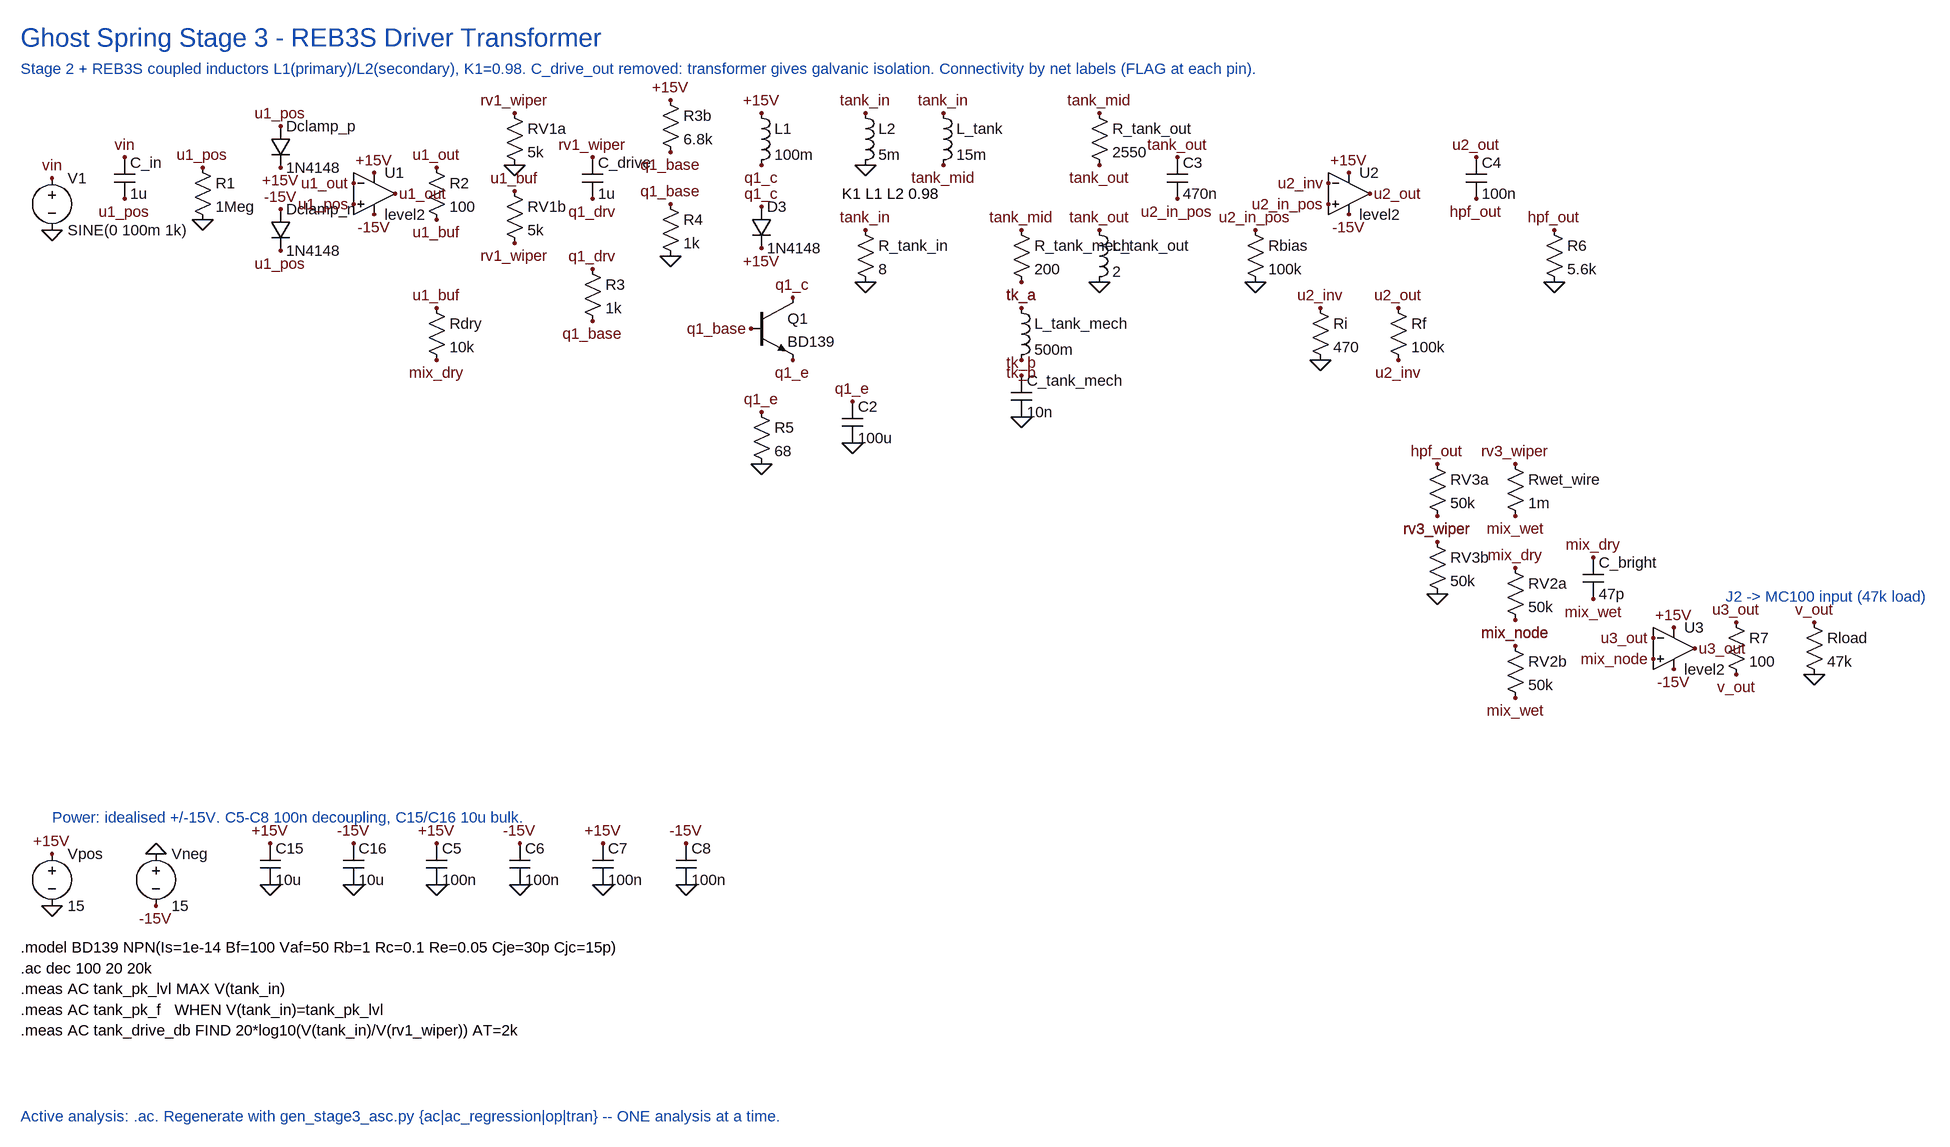
[diagram p0: schematic stage_03_transformer.asc]
stage_03_transformer.asc, the LTspice schematic file:
Version 4
SHEET 1 2400 1600
TEXT 16 -40 Left 4 Ghost Spring Stage 3 - REB3S Driver Transformer
TEXT 16 8 Left 2 Stage 2 + REB3S coupled inductors L1(primary)/L2(secondary), K1=0.98. C_drive_out removed: transformer gives galvanic isolation. Connectivity by net labels (FLAG at each pin).
SYMBOL voltage 64 1200 R0
SYMATTR InstName Vpos
SYMATTR Value 15
FLAG 64 1216 +15V
FLAG 64 1296 0
SYMBOL voltage 224 1200 R0
SYMATTR InstName Vneg
SYMATTR Value 15
FLAG 224 1216 0
FLAG 224 1296 -15V
SYMBOL cap 384 1200 R0
SYMATTR InstName C15
SYMATTR Value 10u
FLAG 400 1200 +15V
FLAG 400 1264 0
SYMBOL cap 512 1200 R0
SYMATTR InstName C16
SYMATTR Value 10u
FLAG 528 1200 -15V
FLAG 528 1264 0
SYMBOL cap 640 1200 R0
SYMATTR InstName C5
SYMATTR Value 100n
FLAG 656 1200 +15V
FLAG 656 1264 0
SYMBOL cap 768 1200 R0
SYMATTR InstName C6
SYMATTR Value 100n
FLAG 784 1200 -15V
FLAG 784 1264 0
SYMBOL cap 896 1200 R0
SYMATTR InstName C7
SYMATTR Value 100n
FLAG 912 1200 +15V
FLAG 912 1264 0
SYMBOL cap 1024 1200 R0
SYMATTR InstName C8
SYMATTR Value 100n
FLAG 1040 1200 -15V
FLAG 1040 1264 0
TEXT 64 1160 Left 2 Power: idealised +/-15V. C5-C8 100n decoupling, C15/C16 10u bulk.
SYMBOL voltage 64 160 R0
SYMATTR InstName V1
SYMATTR Value SINE(0 100m 1k)
SYMATTR Value2 AC 1
FLAG 64 176 vin
FLAG 64 256 0
SYMBOL cap 160 144 R0
SYMATTR InstName C_in
SYMATTR Value 1u
FLAG 176 144 vin
FLAG 176 208 u1_pos
SYMBOL res 280 144 R0
SYMATTR InstName R1
SYMATTR Value 1Meg
FLAG 296 160 u1_pos
FLAG 296 240 0
SYMBOL diode 400 96 R0
SYMATTR InstName Dclamp_p
SYMATTR Value 1N4148
FLAG 416 96 u1_pos
FLAG 416 160 +15V
SYMBOL diode 400 224 R0
SYMATTR InstName Dclamp_n
SYMATTR Value 1N4148
FLAG 416 224 -15V
FLAG 416 288 u1_pos
SYMBOL UniversalOpamp2 560 200 R0
SYMATTR InstName U1
SYMATTR Value level2
SYMATTR Value2 Avol=1Meg GBW=8Meg Slew=20Meg Ilimit=25m Rail=0 Rinc=1T
FLAG 528 216 u1_pos
FLAG 528 184 u1_out
FLAG 560 168 +15V
FLAG 560 232 -15V
FLAG 592 200 u1_out
SYMBOL res 640 144 R0
SYMATTR InstName R2
SYMATTR Value 100
FLAG 656 160 u1_out
FLAG 656 240 u1_buf
SYMBOL res 760 60 R0
SYMATTR InstName RV1a
SYMATTR Value 5k
FLAG 776 76 rv1_wiper
FLAG 776 156 0
SYMBOL res 760 180 R0
SYMATTR InstName RV1b
SYMATTR Value 5k
FLAG 776 196 u1_buf
FLAG 776 276 rv1_wiper
SYMBOL cap 880 144 R0
SYMATTR InstName C_drive
SYMATTR Value 1u
FLAG 896 144 rv1_wiper
FLAG 896 208 q1_drv
SYMBOL res 1000 40 R0
SYMATTR InstName R3b
SYMATTR Value 6.8k
FLAG 1016 56 +15V
FLAG 1016 136 q1_base
SYMBOL res 1000 200 R0
SYMATTR InstName R4
SYMATTR Value 1k
FLAG 1016 216 q1_base
FLAG 1016 296 0
SYMBOL res 880 300 R0
SYMATTR InstName R3
SYMATTR Value 1k
FLAG 896 316 q1_drv
FLAG 896 396 q1_base
SYMBOL npn 1140 360 R0
SYMATTR InstName Q1
SYMATTR Value BD139
FLAG 1140 408 q1_base
FLAG 1204 360 q1_c
FLAG 1204 456 q1_e
SYMBOL res 1140 520 R0
SYMATTR InstName R5
SYMATTR Value 68
FLAG 1156 536 q1_e
FLAG 1156 616 0
SYMBOL cap 1280 520 R0
SYMATTR InstName C2
SYMATTR Value 100u
FLAG 1296 520 q1_e
FLAG 1296 584 0
SYMBOL diode 1140 220 R0
SYMATTR InstName D3
SYMATTR Value 1N4148
FLAG 1156 220 q1_c
FLAG 1156 284 +15V
SYMBOL ind 1140 60 R0
SYMATTR InstName L1
SYMATTR Value 100m
SYMATTR SpiceLine Rser=0
FLAG 1156 76 +15V
FLAG 1156 156 q1_c
SYMBOL ind 1300 60 R0
SYMATTR InstName L2
SYMATTR Value 5m
SYMATTR SpiceLine Rser=0
FLAG 1316 76 tank_in
FLAG 1316 156 0
TEXT 1280 200 Left 2 !K1 L1 L2 0.98
SYMBOL res 1300 240 R0
SYMATTR InstName R_tank_in
SYMATTR Value 8
FLAG 1316 256 tank_in
FLAG 1316 336 0
SYMBOL ind 1420 60 R0
SYMATTR InstName L_tank
SYMATTR Value 15m
SYMATTR SpiceLine Rser=0
FLAG 1436 76 tank_in
FLAG 1436 156 tank_mid
SYMBOL res 1540 240 R0
SYMATTR InstName R_tank_mech
SYMATTR Value 200
FLAG 1556 256 tank_mid
FLAG 1556 336 tk_a
SYMBOL ind 1540 360 R0
SYMATTR InstName L_tank_mech
SYMATTR Value 500m
SYMATTR SpiceLine Rser=0
FLAG 1556 376 tk_a
FLAG 1556 456 tk_b
SYMBOL cap 1540 480 R0
SYMATTR InstName C_tank_mech
SYMATTR Value 10n
FLAG 1556 480 tk_b
FLAG 1556 544 0
SYMBOL res 1660 60 R0
SYMATTR InstName R_tank_out
SYMATTR Value 2550
FLAG 1676 76 tank_mid
FLAG 1676 156 tank_out
SYMBOL ind 1660 240 R0
SYMATTR InstName L_tank_out
SYMATTR Value 2
SYMATTR SpiceLine Rser=0
FLAG 1676 256 tank_out
FLAG 1676 336 0
SYMBOL cap 1780 144 R0
SYMATTR InstName C3
SYMATTR Value 470n
FLAG 1796 144 tank_out
FLAG 1796 208 u2_in_pos
SYMBOL res 1900 240 R0
SYMATTR InstName Rbias
SYMATTR Value 100k
FLAG 1916 256 u2_in_pos
FLAG 1916 336 0
SYMBOL UniversalOpamp2 2060 200 R0
SYMATTR InstName U2
SYMATTR Value level2
SYMATTR Value2 Avol=1Meg GBW=8Meg Slew=20Meg Ilimit=25m Rail=0 Rinc=1T
FLAG 2028 216 u2_in_pos
FLAG 2028 184 u2_inv
FLAG 2060 168 +15V
FLAG 2060 232 -15V
FLAG 2092 200 u2_out
SYMBOL res 2000 360 R0
SYMATTR InstName Ri
SYMATTR Value 470
FLAG 2016 376 u2_inv
FLAG 2016 456 0
SYMBOL res 2120 360 R0
SYMATTR InstName Rf
SYMATTR Value 100k
FLAG 2136 376 u2_out
FLAG 2136 456 u2_inv
SYMBOL cap 2240 144 R0
SYMATTR InstName C4
SYMATTR Value 100n
FLAG 2256 144 u2_out
FLAG 2256 208 hpf_out
SYMBOL res 2360 240 R0
SYMATTR InstName R6
SYMATTR Value 5.6k
FLAG 2376 256 hpf_out
FLAG 2376 336 0
SYMBOL res 2180 600 R0
SYMATTR InstName RV3a
SYMATTR Value 50k
FLAG 2196 616 hpf_out
FLAG 2196 696 rv3_wiper
SYMBOL res 2180 720 R0
SYMATTR InstName RV3b
SYMATTR Value 50k
FLAG 2196 736 rv3_wiper
FLAG 2196 816 0
SYMBOL res 640 360 R0
SYMATTR InstName Rdry
SYMATTR Value 10k
FLAG 656 376 u1_buf
FLAG 656 456 mix_dry
SYMBOL res 2300 760 R0
SYMATTR InstName RV2a
SYMATTR Value 50k
FLAG 2316 776 mix_dry
FLAG 2316 856 mix_node
SYMBOL res 2300 880 R0
SYMATTR InstName RV2b
SYMATTR Value 50k
FLAG 2316 896 mix_node
FLAG 2316 976 mix_wet
SYMBOL cap 2420 760 R0
SYMATTR InstName C_bright
SYMATTR Value 47p
FLAG 2436 760 mix_dry
FLAG 2436 824 mix_wet
SYMBOL res 2300 600 R0
SYMATTR InstName Rwet_wire
SYMATTR Value 1m
FLAG 2316 616 rv3_wiper
FLAG 2316 696 mix_wet
SYMBOL UniversalOpamp2 2560 900 R0
SYMATTR InstName U3
SYMATTR Value level2
SYMATTR Value2 Avol=1Meg GBW=8Meg Slew=20Meg Ilimit=25m Rail=0 Rinc=1T
FLAG 2528 916 mix_node
FLAG 2528 884 u3_out
FLAG 2560 868 +15V
FLAG 2560 932 -15V
FLAG 2592 900 u3_out
SYMBOL res 2640 844 R0
SYMATTR InstName R7
SYMATTR Value 100
FLAG 2656 860 u3_out
FLAG 2656 940 v_out
SYMBOL res 2760 844 R0
SYMATTR InstName Rload
SYMATTR Value 47k
FLAG 2776 860 v_out
FLAG 2776 940 0
TEXT 2640 820 Left 2 J2 -> MC100 input (47k load)
TEXT 16 1620 Left 2 Active analysis: .ac. Regenerate with gen_stage3_asc.py {ac|ac_regression|op|tran} -- ONE analysis at a time.
TEXT 16 1360 Left 2 !.model BD139 NPN(Is=1e-14 Bf=100 Vaf=50 Rb=1 Rc=0.1 Re=0.05 Cje=30p Cjc=15p)
TEXT 16 1392 Left 2 !.ac dec 100 20 20k
TEXT 16 1424 Left 2 !.meas AC tank_pk_lvl MAX V(tank_in)
TEXT 16 1456 Left 2 !.meas AC tank_pk_f   WHEN V(tank_in)=tank_pk_lvl
TEXT 16 1488 Left 2 !.meas AC tank_drive_db FIND 20*log10(V(tank_in)/V(rv1_wiper)) AT=2k

The netlist it stands for:
* stage_03_transformer.asc
Vpos +15V 0 15
Vneg 0 -15V 15
C15 +15V 0 10u
C16 -15V 0 10u
C5 +15V 0 100n
C6 -15V 0 100n
C7 +15V 0 100n
C8 -15V 0 100n
V1 vin 0 SINE(0 100m 1k) AC 1
C_in vin u1_pos 1u
R1 u1_pos 0 1Meg
Dclamp_p u1_pos +15V 1N4148
Dclamp_n -15V u1_pos 1N4148
XU1 u1_pos u1_out +15V -15V u1_out level.2 level2 Avol=1Meg GBW=8Meg Slew=20Meg Ilimit=25m Rail=0 Rinc=1T ilimit=25m rail=0 Vos=0 phimargin=45 en=0 enk=0 in=0 ink=0 Rin=500Meg  ; pins IN+ IN- V+ V- OUT
R2 u1_out u1_buf 100
RV1a rv1_wiper 0 5k
RV1b u1_buf rv1_wiper 5k
C_drive rv1_wiper q1_drv 1u
R3b +15V q1_base 6.8k
R4 q1_base 0 1k
R3 q1_drv q1_base 1k
Q1 q1_c q1_base q1_e 0 BD139
R5 q1_e 0 68
C2 q1_e 0 100u
D3 q1_c +15V 1N4148
L1 +15V q1_c 100m Rser=0
L2 tank_in 0 5m Rser=0
R_tank_in tank_in 0 8
L_tank tank_in tank_mid 15m Rser=0
R_tank_mech tank_mid tk_a 200
L_tank_mech tk_a tk_b 500m Rser=0
C_tank_mech tk_b 0 10n
R_tank_out tank_mid tank_out 2550
L_tank_out tank_out 0 2 Rser=0
C3 tank_out u2_in_pos 470n
Rbias u2_in_pos 0 100k
XU2 u2_in_pos u2_inv +15V -15V u2_out level.2 level2 Avol=1Meg GBW=8Meg Slew=20Meg Ilimit=25m Rail=0 Rinc=1T ilimit=25m rail=0 Vos=0 phimargin=45 en=0 enk=0 in=0 ink=0 Rin=500Meg  ; pins IN+ IN- V+ V- OUT
Ri u2_inv 0 470
Rf u2_out u2_inv 100k
C4 u2_out hpf_out 100n
R6 hpf_out 0 5.6k
RV3a hpf_out rv3_wiper 50k
RV3b rv3_wiper 0 50k
Rdry u1_buf mix_dry 10k
RV2a mix_dry mix_node 50k
RV2b mix_node mix_wet 50k
C_bright mix_dry mix_wet 47p
Rwet_wire rv3_wiper mix_wet 1m
XU3 mix_node u3_out +15V -15V u3_out level.2 level2 Avol=1Meg GBW=8Meg Slew=20Meg Ilimit=25m Rail=0 Rinc=1T ilimit=25m rail=0 Vos=0 phimargin=45 en=0 enk=0 in=0 ink=0 Rin=500Meg  ; pins IN+ IN- V+ V- OUT
R7 u3_out v_out 100
Rload v_out 0 47k
.model D D
.lib standard.dio
.model NPN NPN
.model PNP PNP
.lib standard.bjt
* Ghost Spring Stage 3 - REB3S Driver Transformer
* Stage 2 + REB3S coupled inductors L1(primary)/L2(secondary), K1=0.98. C_drive_out removed: transformer gives galvanic isolation. Connectivity by net labels (FLAG at each pin).
* Power: idealised +/-15V. C5-C8 100n decoupling, C15/C16 10u bulk.
K1 L1 L2 0.98
* J2 -> MC100 input (47k load)
* Active analysis: .ac. Regenerate with gen_stage3_asc.py {ac|ac_regression|op|tran} -- ONE analysis at a time.
.model BD139 NPN(Is=1e-14 Bf=100 Vaf=50 Rb=1 Rc=0.1 Re=0.05 Cje=30p Cjc=15p)
.ac dec 100 20 20k
.meas AC tank_pk_lvl MAX V(tank_in)
.meas AC tank_pk_f   WHEN V(tank_in)=tank_pk_lvl
.meas AC tank_drive_db FIND 20*log10(V(tank_in)/V(rv1_wiper)) AT=2k
.lib UniversalOpamps2.sub
.backanno
.end